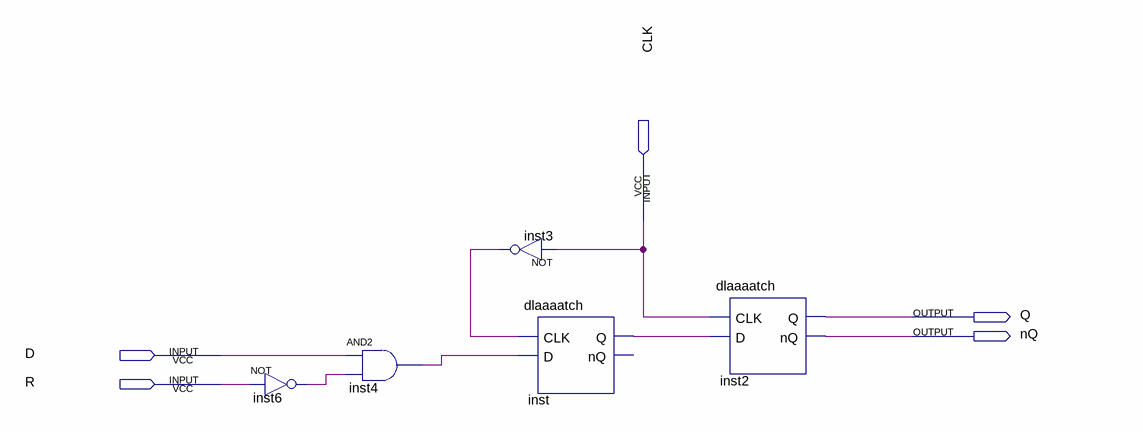
[diagram p0: schematic sheet]
// Quartus schematic dflipflopR.bdf as structural Verilog: 5 symbols, 5 pins
module dflipflopR (
  input  CLK,
  input  D,
  input  R,
  output Q,
  output nQ
);

  wire inst3_out, inst4_out, inst6_out, inst_q;

  not inst6 (inst6_out, R);
  and inst4 (inst4_out, D, inst6_out);
  not inst3 (inst3_out, CLK);
  dlaaaatch inst (.CLK(inst3_out), .D(inst4_out), .Q(inst_q));  // open: nQ
  dlaaaatch inst2 (.CLK(CLK), .D(inst_q), .Q(Q), .nQ(nQ));
endmodule
